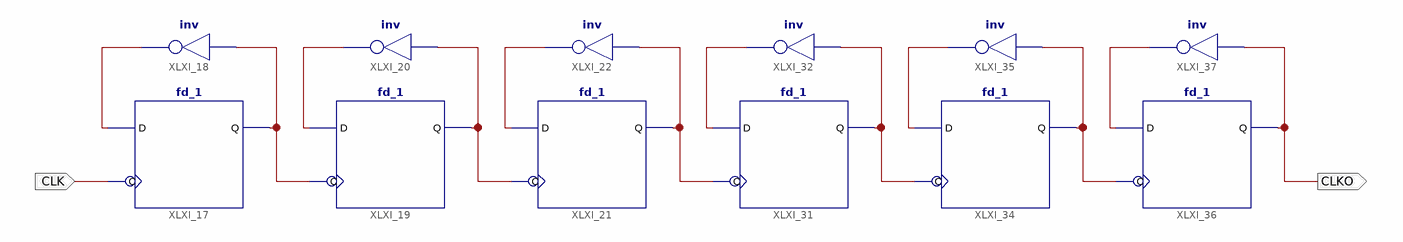
[diagram p0: schematic sheet 1]
// Xilinx ISE schematic clkdiv64.sch (spartan6) as structural Verilog: 12 symbols, 2 ports
module clkdiv64 (
  input  CLK,
  output CLKO
);

  wire XLXN_27, XLXN_28, XLXN_29, XLXN_9999, XLXN_10000, XLXN_10001, XLXN_10012, XLXN_10013, XLXN_10016,
       XLXN_10017, XLXN_10018;

  fd_1 XLXI_17 (.C(CLK), .D(XLXN_27), .Q(XLXN_9999));
  not XLXI_18 (XLXN_27, XLXN_9999);
  fd_1 XLXI_19 (.C(XLXN_9999), .D(XLXN_29), .Q(XLXN_28));
  not XLXI_20 (XLXN_29, XLXN_28);
  fd_1 XLXI_21 (.C(XLXN_28), .D(XLXN_10001), .Q(XLXN_10000));
  not XLXI_22 (XLXN_10001, XLXN_10000);
  fd_1 XLXI_31 (.C(XLXN_10000), .D(XLXN_10012), .Q(XLXN_10013));
  not XLXI_32 (XLXN_10012, XLXN_10013);
  fd_1 XLXI_36 (.C(XLXN_10017), .D(XLXN_10018), .Q(CLKO));
  not XLXI_37 (XLXN_10018, CLKO);
  not XLXI_35 (XLXN_10016, XLXN_10017);
  fd_1 XLXI_34 (.C(XLXN_10013), .D(XLXN_10016), .Q(XLXN_10017));
endmodule
